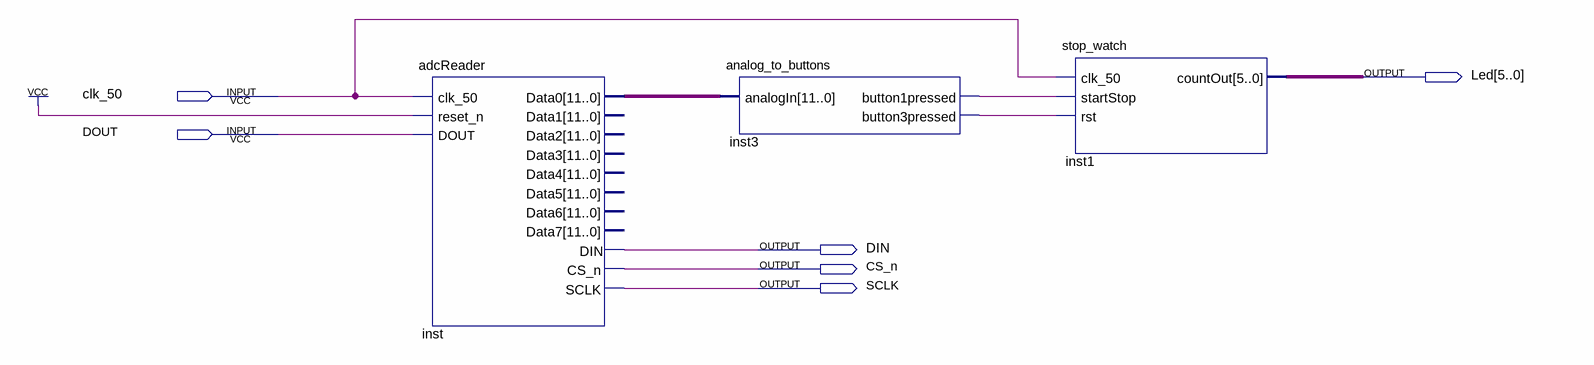
[diagram p0: schematic sheet]
// Quartus schematic StopWatch.bdf as structural Verilog: 3 symbols, 6 pins
module StopWatch (
  input  clk_50,
  input  DOUT,
  output [5:0] Led,
  output DIN,
  output CS_n,
  output SCLK
);

  wire inst3_button1pressed, inst3_button3pressed;
  wire [11:0] inst_data0;

  adcReader inst (
    .clk_50(clk_50), .reset_n(1'b1), .DOUT(DOUT), .Data0(inst_data0), .DIN(DIN), .CS_n(CS_n), .SCLK(SCLK));  // open: Data1, Data2, Data3, Data4, Data5, Data6, Data7
  analog_to_buttons inst3 (
    .analogIn(inst_data0), .button1pressed(inst3_button1pressed), .button3pressed(inst3_button3pressed));
  stop_watch inst1 (.clk_50(clk_50), .startStop(inst3_button1pressed), .rst(inst3_button3pressed), .countOut(Led));
endmodule
